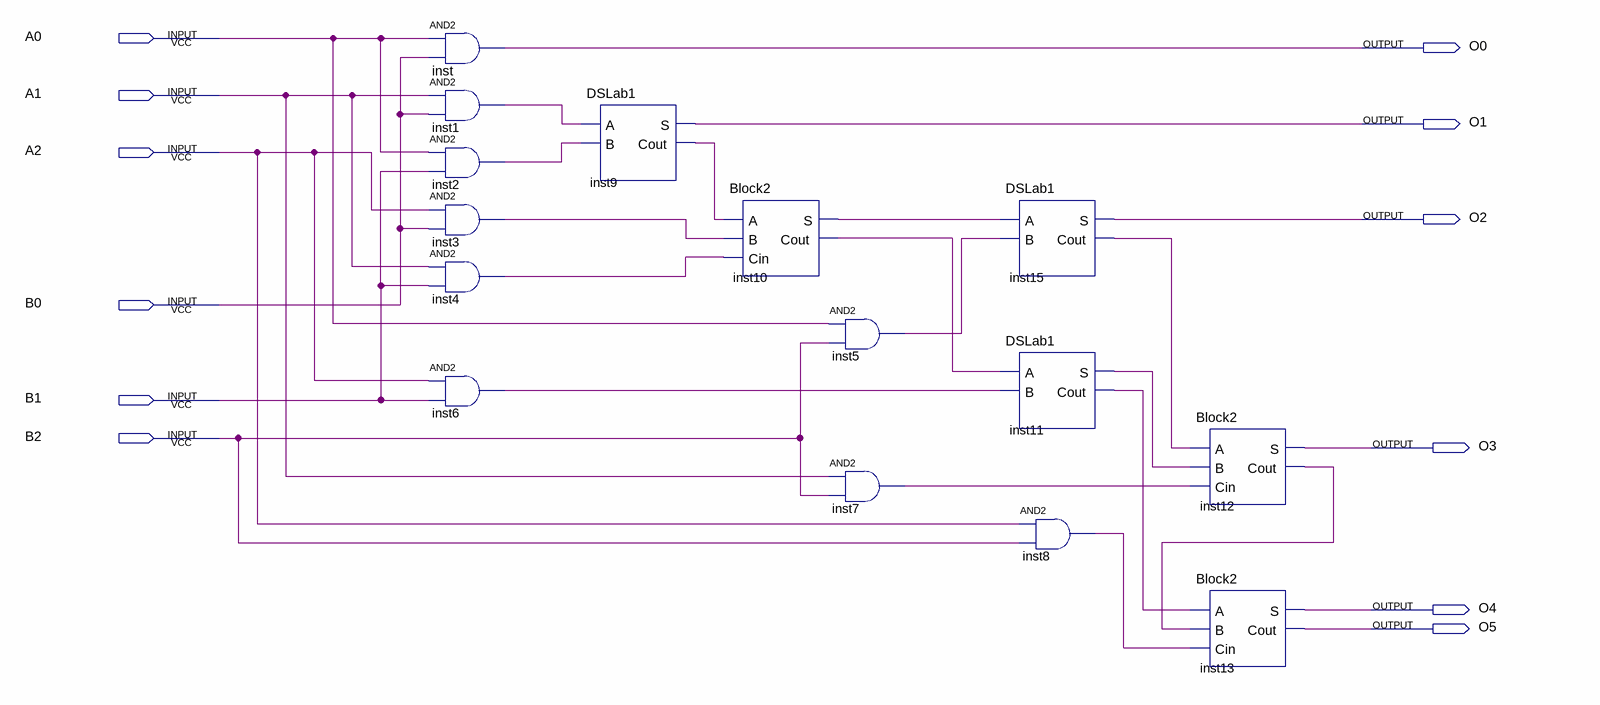
[diagram p0: schematic sheet]
// Quartus schematic Block3.bdf as structural Verilog: 15 symbols, 12 pins
module Block3 (
  input  A0,
  input  A1,
  input  A2,
  input  B0,
  input  B1,
  input  B2,
  output O0,
  output O1,
  output O2,
  output O3,
  output O4,
  output O5
);

  wire inst1_out, inst2_out, inst3_out, inst4_out, inst5_out, inst6_out, inst7_out, inst8_out, inst9_cout,
       inst10_cout, inst10_s, inst11_cout, inst11_s, inst12_cout, inst15_cout;

  and inst (O0, A0, B0);
  and inst1 (inst1_out, A1, B0);
  and inst2 (inst2_out, A0, B1);
  and inst3 (inst3_out, A2, B0);
  and inst4 (inst4_out, A1, B1);
  and inst6 (inst6_out, A2, B1);
  DSLab1 inst9 (.A(inst1_out), .B(inst2_out), .S(O1), .Cout(inst9_cout));
  Block2 inst10 (.A(inst9_cout), .B(inst3_out), .Cin(inst4_out), .S(inst10_s), .Cout(inst10_cout));
  and inst5 (inst5_out, A0, B2);
  and inst7 (inst7_out, A1, B2);
  DSLab1 inst15 (.A(inst10_s), .B(inst5_out), .S(O2), .Cout(inst15_cout));
  DSLab1 inst11 (.A(inst10_cout), .B(inst6_out), .S(inst11_s), .Cout(inst11_cout));
  and inst8 (inst8_out, A2, B2);
  Block2 inst12 (.A(inst15_cout), .B(inst11_s), .Cin(inst7_out), .S(O3), .Cout(inst12_cout));
  Block2 inst13 (.A(inst11_cout), .B(inst12_cout), .Cin(inst8_out), .S(O4), .Cout(O5));
endmodule
